# Altium schematic sheet main.SchDoc
size A; SheetNumber: 1; SheetTotal: 2
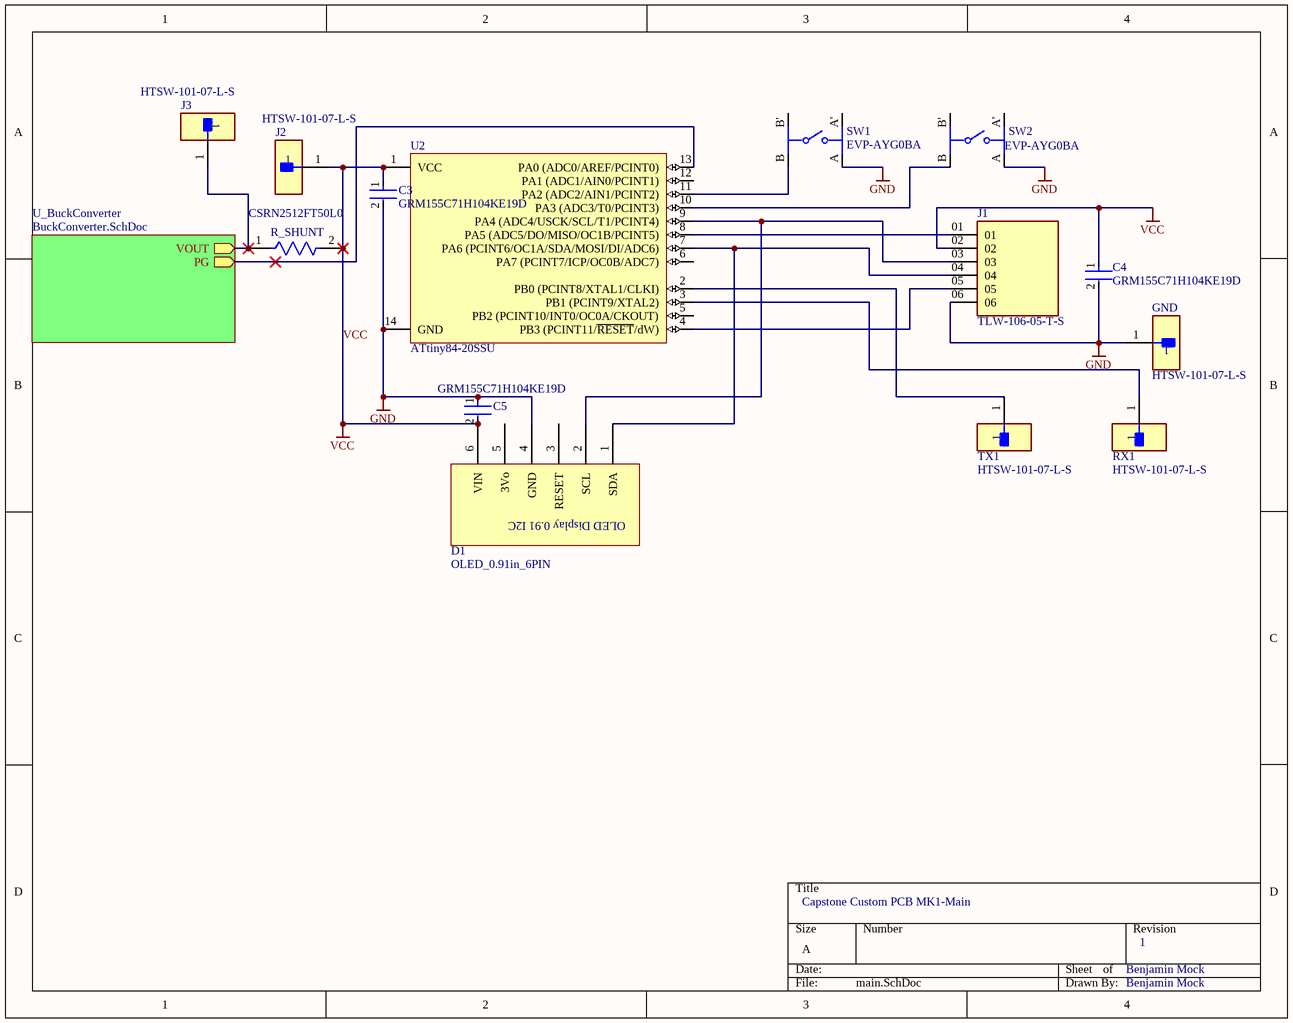
[diagram p0: main.SchDoc]

## Parts
C3  GRM155C71H104KE19D  [FP-GRM155-0_05-MFG]
C4  GRM155C71H104KE19D  [FP-GRM155-0_05-MFG]
C5  GRM155C71H104KE19D  [FP-GRM155-0_05-MFG]
D1  OLED_0.91in_6PIN  [PCBComponent_1]
GND  HTSW-101-07-L-S  [FP-HTSW-101-07-L-S-MFG]
J1  TLW-106-05-T-S  [SAMTEC_TLW-106-05-T-S]
J2  HTSW-101-07-L-S  [FP-HTSW-101-07-L-S-MFG]
J3  HTSW-101-07-L-S  [FP-HTSW-101-07-L-S-MFG]
R_SHUNT  CSRN2512FT50L0  [FP-CSRN2512-IPC_B]
RX1  HTSW-101-07-L-S  [FP-HTSW-101-07-L-S-MFG]
SW1  EVP-AYG0BA  [FP-EVP-AYG0BA-MFG]
SW2  EVP-AYG0BA  [FP-EVP-AYG0BA-MFG]
TX1  HTSW-101-07-L-S  [FP-HTSW-101-07-L-S-MFG]
U2  ATtiny84-20SSU  [14S1_N]

## Sub-sheets
U_BuckConverter = BuckConverter.SchDoc: VOUT (out), PG (out)

## Nets
GND: C3.2 C4.2 C5.1 D1.4(GND) GND.1 J1.06 SW1.A SW2.A U2.14(GND)
VCC: C3.1 C4.1 C5.2 D1.6(VIN) J1.02 J2.1 R_SHUNT.2 U2.1(VCC)
NetD1_1: D1.1(SDA) J1.04 U2.7(PA6_(PCINT6/OC1A/SDA/MOSI/DI/ADC6))
NetD1_2: D1.2(SCL) J1.03 U2.9(PA4_(ADC4/USCK/SCL/T1/PCINT4))
NetJ1_01: J1.01 U2.8(PA5_(ADC5/DO/MISO/OC1B/PCINT5))
NetJ1_05: J1.05 U2.4(PB3_(PCINT11/~{RESET}/dW))
NetJ3_1: J3.1 R_SHUNT.1 ; sheet U_BuckConverter/VOUT
NetRX1_1: RX1.1 U2.3(PB1_(PCINT9/XTAL2))
NetSW1_B: SW1.B U2.11(PA2_(ADC2/AIN1/PCINT2))
NetSW2_B: SW2.B U2.10(PA3_(ADC3/T0/PCINT3))
NetTX1_1: TX1.1 U2.2(PB0_(PCINT8/XTAL1/CLKI))
NetU2_13: U2.13(PA0_(ADC0/AREF/PCINT0)) ; sheet U_BuckConverter/PG

Not connected (* = marked no-connect by the designer): D1 3(RESET) 5(3Vo); SW1 A' B'; SW2 A' B'; U2 5(PB2_(PCINT10/INT0/OC0A/CKOUT)) 6(PA7_(PCINT7/ICP/OC0B/ADC7)) 12(PA1_(ADC1/AIN0/PCINT1))

## Notes on the sheet
- Capstone Custom PCB MK1-Main
- Benjamin Mock
- 1
- (in symbol OLED_0.91in_6PIN) OLED Display 0.91 I2C

## Library data of the parts
C3-C5 = CMP-06035-019038-1: Chip Multilayer Ceramic Capacitors for General Purpose, 0402, 0.10uF, X7S, 22%, 10%, 50V; Capacitance: 100nF; Voltage Rating (DC): 50V; Dielectric: X7S; Width: 500um; Thickness: 500um; Length: 1mm; Tolerance: 10%
GND J2 J3 RX1 TX1 = CMP-02766-001464-1: CONN HEADER VERT 1POS; Number of Contacts: 1; Max Voltage Rating (AC): 550V; Gender: Male; Max Current Rating: 7.6A; Contact Material: Bronze; REACH SVHC: No SVHC; Contact Plating: Gold; Length: 2.54mm; Housing Color: Natural; Number of Rows: 1; Orientation: Straight; Max Operating Temperature: 125°C; Min Operating Temperature: -55°C; RoHS Compliant: Yes; Housing Material: Polymer; Packaging: Bulk; Depth: 2.48mm; Termination: Solder; Radiation Hardening: No
R_SHUNT = CMP-26527-002421-1: Res Thick Film 2512 50mΩ 1% 2W ±200ppm/°C Molded SMD Plastic T/R; Resistance: 50mR; Temperature Coefficient: 200ppm/°C; Length: 0.25inch; Package Quantity: 4000; Resistor Type: Thick Film; Case/Package: 2512; Width: 0.124inch; Series: CSRN; Height: 0.028inch; Tolerance: 1%; Number of Terminations: 2; Packaging: Tape and Reel; Min Operating Temperature: -55°C; Mount: Surface Mount; Max Power Dissipation: 2W; Max Operating Temperature: 155°C
SW1 SW2 = CMP-05618-000108-1: SWITCH TACTILE SPST-NO 0.02A 15V; Actuator Type: Standard; Illumination Type: Non-Illuminated; Operating Force: 240gf; Switch Function: Off-Mom; Mechanical Life: 500000Cycles; Throw Configuration: SPST; Switch Travel: 0.15mm; Packaging: Tape and Reel; Max Operating Temperature: 85°C; Min Operating Temperature: -40°C; Mount: Surface Mount
U2 = CMP-0093-00133-2: 8-bit AVR Microcontroller, 20MHz, 2.7-5.5V, 8KB Flash, 512 Bytes EEPROM, 512 Bytes SRAM, 14-pin SOIC, Industrial Grade (-40°C to 85°C), Pb-Free; ComponentLink3Description: ATtiny24/44/84 Summary; Code_JEDEC: MS-012-AB; DatasheetVersion: revK, Oct-2010; PackageReference: 14S1; Code_IPC: SOIC127P600-14; PackageDescription: 14-Lead, 0.150â€ Wide Body, Plastic Gull Wing Small Outline Package (SOIC); PackageVersion: revA, Feb-2002; ComponentLink2URL: http://www.atmel.com/dyn/resources/prod_documents/doc8006.pdf; RevisionNote: DatasheetVersion updated. URLs added.; ComponentLink2Description: ATtiny24/44/84 Datasheet; ComponentLink1URL: http://www.atmel.com/; ComponentLink1Description: Manufacturer URL; ComponentLink3URL: http://www.atmel.com/dyn/resources/prod_documents/8006S.pdf
J1 = TLW-106-05-T-S: Price: None; MP: TLW-106-05-T-S; Value: *; Availability: Unavailable; Package: None